# EAGLE schematic pta_series_pot_test (EAGLE 7.6.0)
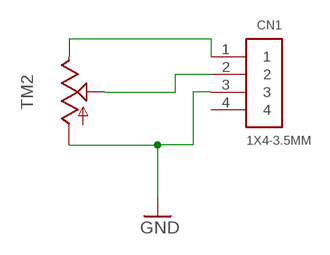
[diagram p0: schematic, sheet 1]

## Parts
CN1  1X4-3.5MM  [1X04-3.5MM]
TM2  TRIMSLIDE60  [SLIDEPOT-60]

## Nets
GND: CN1.3 TM2.A
N$1: CN1.1 TM2.B
N$2: CN1.2 TM2.WIPER
Unconnected: CN1.4

## Library data of the parts
CN1 = adafruit:1X4: 4-pin connector
TM2 = stefan-lochbrunner_EAGLE_master_custom libraries_potentiometers_Bourns PTA series_Bourns PTA series:TRIM: Sliding potentiometers Based on Adafruits (https://github.com/adafruit/Adafruit-Eagle-Library) 'TRIM' device. For Bourns PTA series and TT Electronics PSxx series potentiometers.